# Altium schematic sheet Headers.SchDoc: Headers
size Letter; Author: Nicholas Sorensen, Tharun Suresh, Erik Halliwell, Stefan Damkjar, and Duncan Elliott; CompanyName: AlbertaSat; Organization: Altium Limited; Revision: 4.1; SheetNumber: 2; SheetTotal: 4; CopyrightYear: 2019
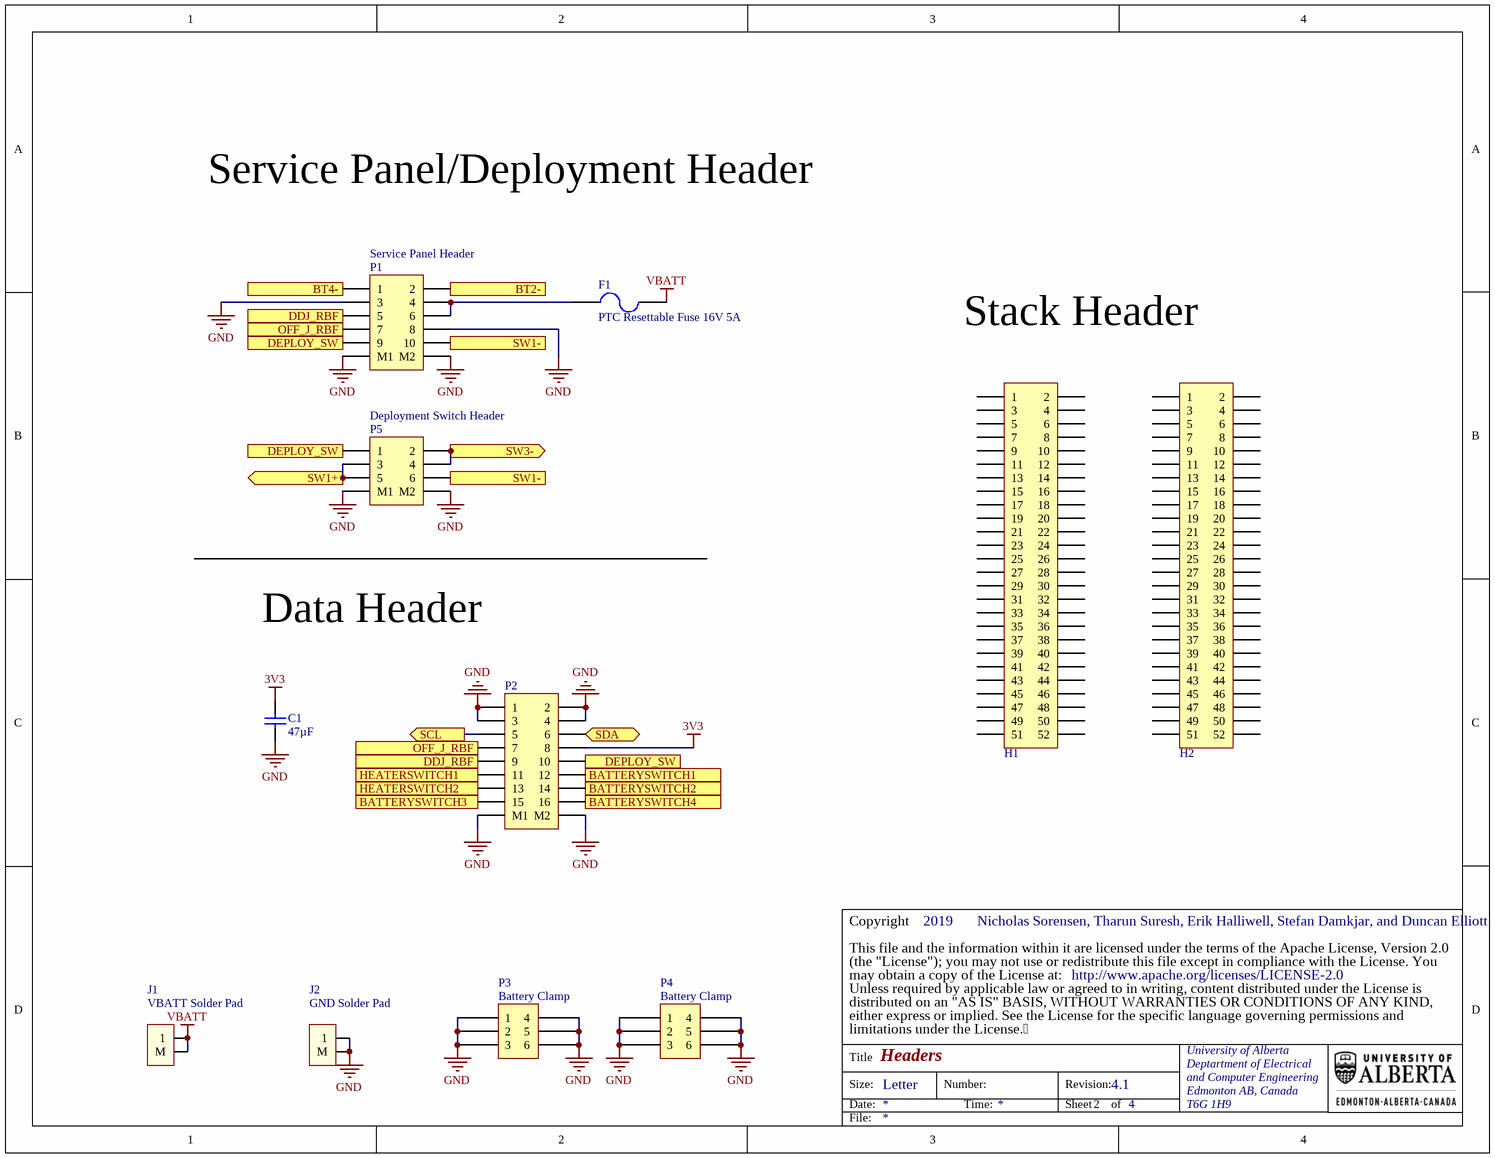
[diagram p0: Headers.SchDoc]

## Parts
C1  value 47µF  [TDK-CGA6P]  (hidden comment: Cap)
F1  PTC Resettable Fuse 16V 5A  [2920L500/16]
H1  SSW-126-23-G-D  [SSW-126-23-G-D]  (value not drawn)
H2  SSW-126-23-G-D  [SSW-126-23-G-D]  (value not drawn)
J1  VBATT Solder Pad  [VBATT-wire-pad]
J2  GND Solder Pad  [GND-WIRE-PAD]
P1  G125-MH11005L1  [HWN-G125-MH11005L1]  (value not drawn)
P2  G125-MH11605L1  [HWN-G125-MH11605L1]  (value not drawn)
P3  Battery Clamp  [Battery Clamp]
P4  Battery Clamp  [Battery Clamp]
P5  G125-MH10605L1  [HWN-G125-MH10605L1]  (value not drawn)

## Ports
BATTERYSWITCH1 (out), BATTERYSWITCH2 (out), BATTERYSWITCH3 (out), BATTERYSWITCH4 (out), BT2- (out), BT4- (out), DDJ_RBF (out), DEPLOY_SW (out), HEATERSWITCH1 (out), HEATERSWITCH2 (out), OFF_J_RBF (out), SCL (out), SDA (bidir), SW1+ (out), SW1- (out), SW3- (out)

## Nets
3V3: C1.2 P2.8
GND: C1.1 J2.1 J2.2(M) P1.3 P1.8 P1.11(M1) P1.12(M2) P2.1 P2.2 P2.3 P2.4 P2.17(M1) P2.18(M2) P3.1 P3.2 P3.3 P3.4 P3.5 P3.6 P4.1 P4.2 P4.3 P4.4 P4.5 P4.6 P5.7(M1) P5.8(M2)
VBATT: F1.1 J1.1 J1.2(M)
BATTERYSWITCH1: P2.12 ; port BATTERYSWITCH1
BATTERYSWITCH2: P2.14 ; port BATTERYSWITCH2
BATTERYSWITCH3: P2.15 ; port BATTERYSWITCH3
BATTERYSWITCH4: P2.16 ; port BATTERYSWITCH4
BT2-: P1.2 ; port BT2-
BT4-: P1.1 ; port BT4-
DDJ_RBF: P1.5 P2.9 ; port DDJ_RBF
DEPLOY_SW: P1.9 P2.10 P5.1 ; port DEPLOY_SW
HEATERSWITCH1: P2.11 ; port HEATERSWITCH1
HEATERSWITCH2: P2.13 ; port HEATERSWITCH2
OFF_J_RBF: P1.7 P2.7 ; port OFF_J_RBF
SCL: P2.5 ; port SCL
SDA: P2.6 ; port SDA
SW1+: P5.3 P5.5 ; port SW1+
SW1-: P1.10 P5.6 ; port SW1-
SW3-: P5.2 P5.4 ; port SW3-
NetF1_2: F1.2 P1.4 P1.6

Not connected (* = marked no-connect by the designer): H1 1 2 3 4 5 6 7 8 9 10 11 12 13 14 15 16 17 18 19 20 21 22 23 24 25 26 27 28 29 30 31 32 33 34 35 36 37 38 39 40 41 42 43 44 45 46 47 48 49 50 51 52; H2 1 2 3 4 5 6 7 8 9 10 11 12 13 14 15 16 17 18 19 20 21 22 23 24 25 26 27 28 29 30 31 32 33 34 35 36 37 38 39 40 41 42 43 44 45 46 47 48 49 50 51 52

## Notes on the sheet
- Service Panel/Deployment Header
- (near P1) Service Panel Header
- Stack Header
- (near P5) Deployment Switch Header
- Data Header
- (the "License"); you may not use or redistribute this file except in compliance with the License. You
- This file and the information within it are licensed under the terms of the Apache License, Version 2.0
- Copyright
- Unless required by applicable law or agreed to in writing, content distributed under the License is
- distributed on an "AS IS" BASIS, WITHOUT WARRANTIES OR CONDITIONS OF ANY KIND,
- either express or implied. See the License for the specific language governing permissions and
- limitations under the License.
- may obtain a copy of the License at:
- http://www.apache.org/licenses/LICENSE-2.0
- Title
- Size:
- Date:
- Letter
- Number:
- Time:
- Revision:
- Sheet
- of
- University of Alberta
- Deptartment of Electrical
- and Computer Engineering
- Edmonton AB, Canada
- T6G 1H9
- File:

## Library data of the parts
C1 = PC-TDK-02951: CAP CER 47UF 6.3V X7S 1210; Manufacturer Part Number: CGA6P1X7S0J476M250AC; Index: 2951; Designator: C?; Tolerance: ±20%; Published: 3/16/2016; LatestRevisionDate: 3/16/2016; LatestRevisionNote: ...; PackageReference: 1210 (3225 Metric); Publisher: AlbertaSat; PackageDescription: Radial Cap, Thru-Hole; 2 Leads; 0.3 in Pin Spacing; Part Number: PC-TDK-02951; Supplier Part Number 1: 445-13045-1-ND; Supplier 1: Digi-key; Supplier Link: http://www.digikey.ca/product-search/en?keywords=445-13045-1-ND; Voltage - Rated: 6.3V; Temperature Coefficient: X7S; Applications: Automotive
F1 = PF-LTF-00001: PTC RESET FUSE 16V 5A 2920; Manufacturer Part Number: 2920L500/16MR; Index: 1; Designator: F?; Published: 7/23/2019; LatestRevisionDate: 7/23/2019; LatestRevisionNote: ...; PackageReference: 2920 (7351 Metric), Concave; Publisher: AlbertaSat; PackageDescription: Thru-Hole; 2 Leads; Part Number: PF-LTF-00001; Supplier Part Number 1: F6136CT-ND; Supplier 1: Digi-key; Supplier Link: https://www.digikey.ca/product-detail/en/littelfuse-inc/2920L500-16MR/F6136CT-ND/4147146
H1 H2 = PP-SAM-00002: Index: 3; Designator: P?; Part Number: PP-SAM-00002; Manufacturer Part Number: SSW-126-23-G-D; Supplier Part Number 1: SSW-126-23-G-D; Supplier 1: Samtec; Publisher: AlbertaSat; Published: 6/7/2018; LatestRevisionDate: 6/7/2018; LatestRevisionNote: ...; Supplier Link: #https://www.samtec.com/products/ssw-126-23-g-d#
J1 J2 = Pad I/O
P1 = PP-HWN-00015: CONN HEADER R/A 10POS 1.25MM; Manufacturer Part Number: G125-MH11005L1P; Index: 15; LatestRevisionDate: 2019-07-08; LatestRevisionNote: ...; Publisher: AlbertaSat; Part Number: PP-HWN-00015; Supplier Part Number 1: 952-2696-ND; Supplier 1: Digi-key; Supplier Part Number 2: 855-G125-MH11005L1P; Supplier 2: Mouser; Published: 2019-07-08; Supplier Link: https://www.digikey.ca/products/en?keywords=952-2696-ND
P2 = PP-HWN-00017: CONN HEADER R/A 16POS 1.25MM; Manufacturer Part Number: G125-MH11605L1P; Index: 17; Designator: P?; LatestRevisionDate: 7/8/2019; LatestRevisionNote: ...; Publisher: AlbertaSat; Part Number: PP-HWN-00017; Supplier Part Number 1: 952-2698-ND; Supplier 1: Digi-key; Supplier Part Number 2: 855-G125-MH11605L1P; Supplier 2: Mouser; Published: 7/8/2019; Supplier Link: https://www.digikey.ca/products/en?keywords=952-2698-ND
P5 = PP-HWN-00014: CONN HEADER R/A 6POS 1.25MM; Manufacturer Part Number: G125-MH10605L1P; Index: 14; Designator: P?; LatestRevisionDate: 2019-07-08; LatestRevisionNote: ...; Publisher: AlbertaSat; Part Number: PP-HWN-00014; Supplier Part Number 1: 952-2695-ND; Supplier 1: Digi-key; Supplier Part Number 2: 855-G125-MH10605L1P; Supplier 2: Mouser; Published: 2019-07-08; Supplier Link: https://www.digikey.ca/products/en?keywords=952-2695-ND